# Altium schematic sheet Bluetooth_Sentinel.SchDoc: Bluetooth Sentinel
size A4
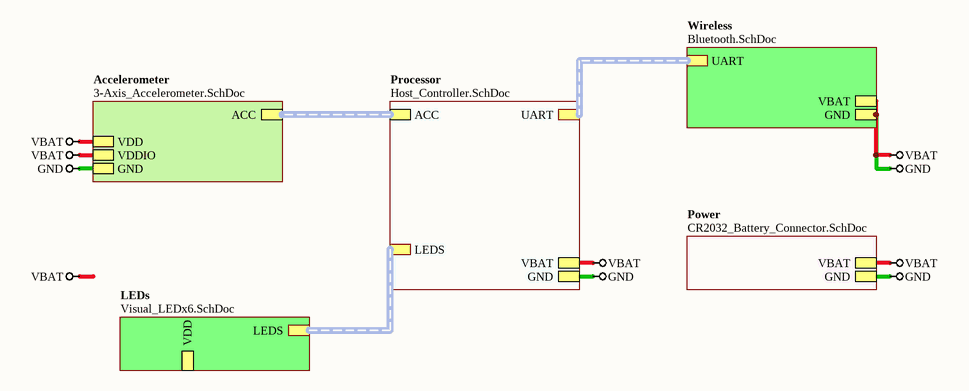
[diagram p0: Bluetooth_Sentinel.SchDoc]

## Sub-sheets
Accelerometer = 3-Axis_Accelerometer.SchDoc: VDD, VDDIO, GND, ACC (harness SPI_LIS331)
LEDs = Visual_LEDx6.SchDoc: VDD, LEDS (harness LEDx6)
Power = CR2032_Battery_Connector.SchDoc: VBAT, GND
Processor = Host_Controller.SchDoc: UART (harness UART_HS), LEDS (harness LEDx6), VBAT, GND, ACC (harness SPI_LIS331)
Wireless = Bluetooth.SchDoc: UART (harness UART_HS), VBAT, GND

## Nets
GND: sheet Power/VBAT, sheet Power/GND, sheet Wireless/VBAT, sheet Wireless/GND, sheet Processor/VBAT, sheet Processor/GND, sheet Accelerometer/VDD, sheet Accelerometer/VDDIO, sheet Accelerometer/GND  [also labelled VBAT]

## Buses and harness runs
harness sheet Accelerometer/ACC = sheet Processor/ACC
harness sheet LEDs/LEDS = sheet Processor/LEDS
harness sheet Processor/UART = sheet Wireless/UART

## Notes on the sheet
- Sheet Title
- Project Title
- Size:
- Date:
- A4
- Item:
- Time:
- Revision:
- Sheet
- of
- File: